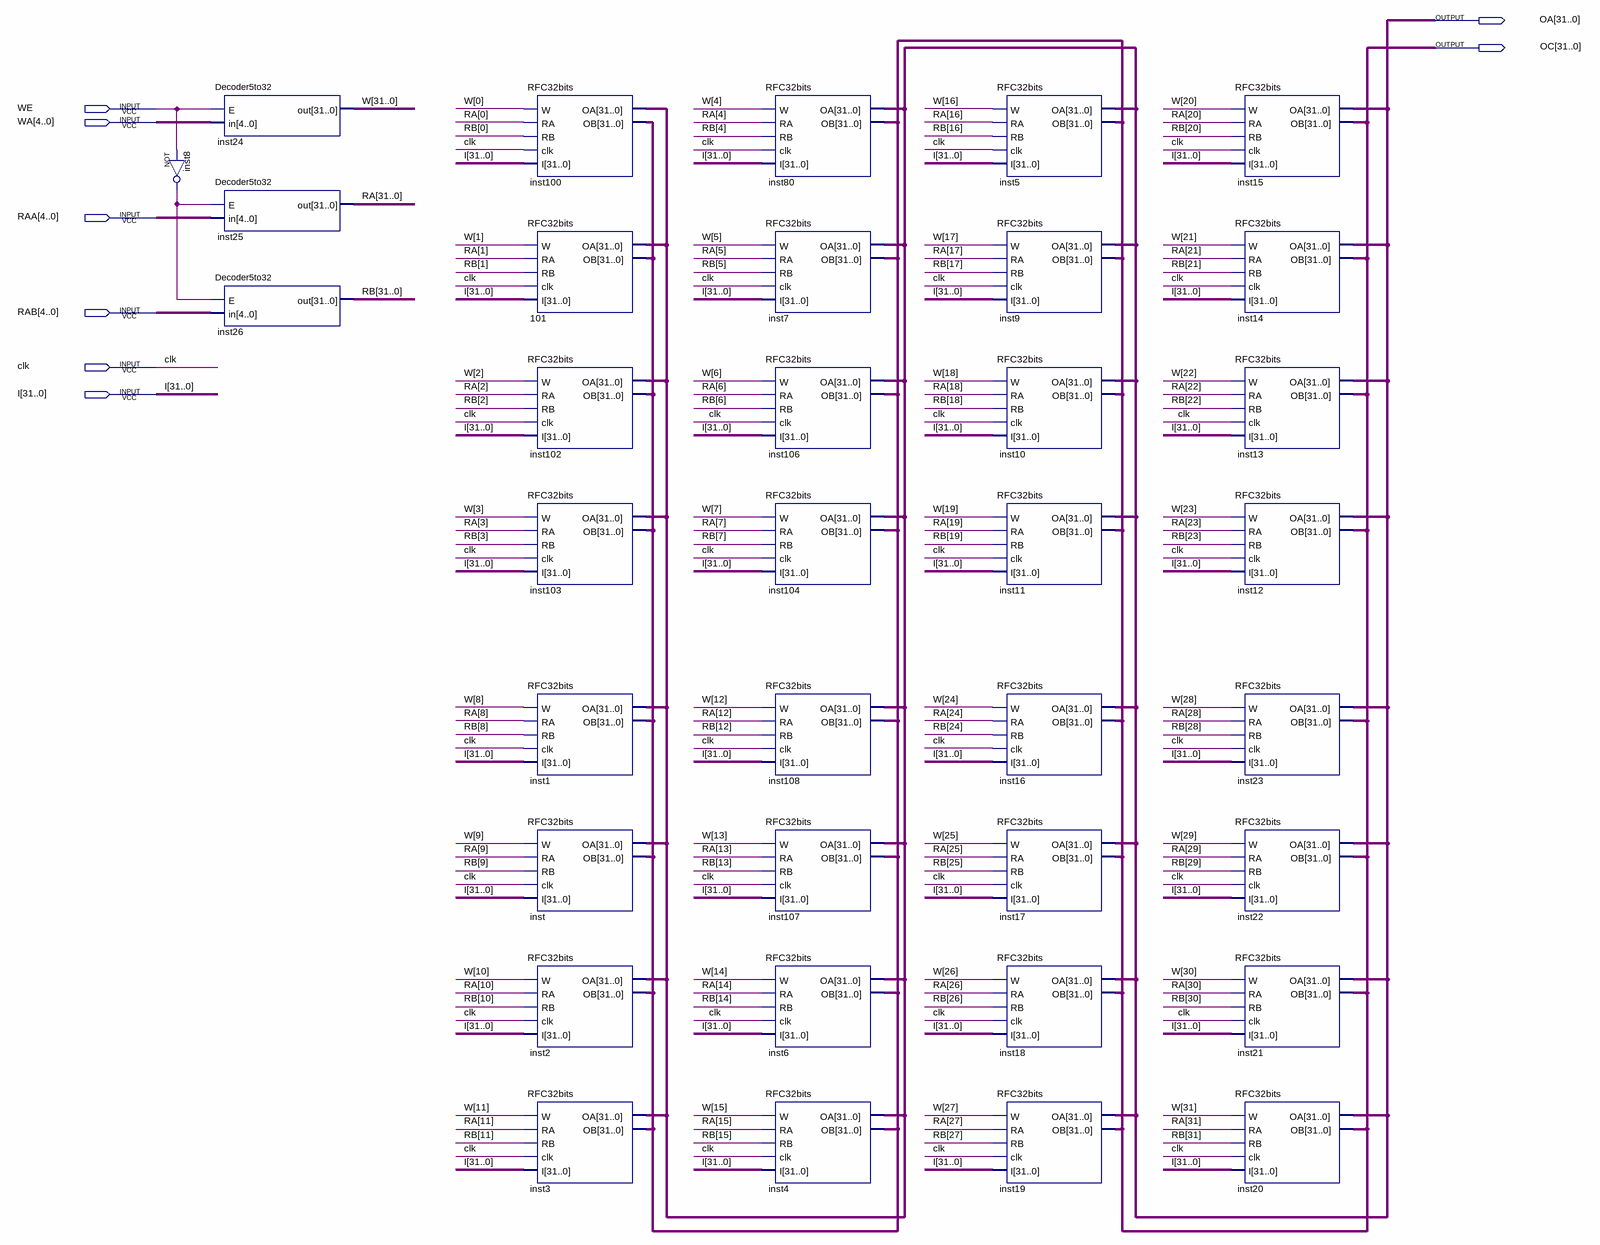
[diagram p0: schematic sheet]
// Quartus schematic RF32-32.bdf as structural Verilog: 36 symbols, 8 pins
module \RF32-32  (
  input  WE,
  input  [4:0] WA,
  input  [4:0] RAA,
  input  [4:0] RAB,
  input  clk,
  input  [31:0] I,
  output [31:0] OA,
  output [31:0] OC
);

  wire inst8_out;
  wire [31:0] RA, RB, W;

  not inst8 (inst8_out, WE);
  Decoder5to32 inst24 (.E(WE), .in(WA), .out(W));
  Decoder5to32 inst25 (.E(inst8_out), .in(RAA), .out(RA));
  Decoder5to32 inst26 (.E(inst8_out), .in(RAB), .out(RB));
  RFC32bits inst100 (.W(W[0]), .RA(RA[0]), .RB(RB[0]), .clk(clk), .I(I), .OA(OA), .OB(OC));
  RFC32bits u_101 (.W(W[1]), .RA(RA[1]), .RB(RB[1]), .clk(clk), .I(I), .OA(OA), .OB(OC));
  RFC32bits inst102 (.W(W[2]), .RA(RA[2]), .RB(RB[2]), .clk(clk), .I(I), .OA(OA), .OB(OC));
  RFC32bits inst103 (.W(W[3]), .RA(RA[3]), .RB(RB[3]), .clk(clk), .I(I), .OA(OA), .OB(OC));
  RFC32bits inst1 (.W(W[8]), .RA(RA[8]), .RB(RB[8]), .clk(clk), .I(I), .OA(OA), .OB(OC));
  RFC32bits inst (.W(W[9]), .RA(RA[9]), .RB(RB[9]), .clk(clk), .I(I), .OA(OA), .OB(OC));
  RFC32bits inst2 (.W(W[10]), .RA(RA[10]), .RB(RB[10]), .clk(clk), .I(I), .OA(OA), .OB(OC));
  RFC32bits inst3 (.W(W[11]), .RA(RA[11]), .RB(RB[11]), .clk(clk), .I(I), .OA(OA), .OB(OC));
  RFC32bits inst80 (.W(W[4]), .RA(RA[4]), .RB(RB[4]), .clk(clk), .I(I), .OA(OA), .OB(OC));
  RFC32bits inst7 (.W(W[5]), .RA(RA[5]), .RB(RB[5]), .clk(clk), .I(I), .OA(OA), .OB(OC));
  RFC32bits inst106 (.W(W[6]), .RA(RA[6]), .RB(RB[6]), .clk(clk), .I(I), .OA(OA), .OB(OC));
  RFC32bits inst104 (.W(W[7]), .RA(RA[7]), .RB(RB[7]), .clk(clk), .I(I), .OA(OA), .OB(OC));
  RFC32bits inst108 (.W(W[12]), .RA(RA[12]), .RB(RB[12]), .clk(clk), .I(I), .OA(OA), .OB(OC));
  RFC32bits inst107 (.W(W[13]), .RA(RA[13]), .RB(RB[13]), .clk(clk), .I(I), .OA(OA), .OB(OC));
  RFC32bits inst6 (.W(W[14]), .RA(RA[14]), .RB(RB[14]), .clk(clk), .I(I), .OA(OA), .OB(OC));
  RFC32bits inst4 (.W(W[15]), .RA(RA[15]), .RB(RB[15]), .clk(clk), .I(I), .OA(OA), .OB(OC));
  RFC32bits inst5 (.W(W[16]), .RA(RA[16]), .RB(RB[16]), .clk(clk), .I(I), .OA(OA), .OB(OC));
  RFC32bits inst9 (.W(W[17]), .RA(RA[17]), .RB(RB[17]), .clk(clk), .I(I), .OA(OA), .OB(OC));
  RFC32bits inst10 (.W(W[18]), .RA(RA[18]), .RB(RB[18]), .clk(clk), .I(I), .OA(OA), .OB(OC));
  RFC32bits inst11 (.W(W[19]), .RA(RA[19]), .RB(RB[19]), .clk(clk), .I(I), .OA(OA), .OB(OC));
  RFC32bits inst16 (.W(W[24]), .RA(RA[24]), .RB(RB[24]), .clk(clk), .I(I), .OA(OA), .OB(OC));
  RFC32bits inst17 (.W(W[25]), .RA(RA[25]), .RB(RB[25]), .clk(clk), .I(I), .OA(OA), .OB(OC));
  RFC32bits inst18 (.W(W[26]), .RA(RA[26]), .RB(RB[26]), .clk(clk), .I(I), .OA(OA), .OB(OC));
  RFC32bits inst19 (.W(W[27]), .RA(RA[27]), .RB(RB[27]), .clk(clk), .I(I), .OA(OA), .OB(OC));
  RFC32bits inst15 (.W(W[20]), .RA(RA[20]), .RB(RB[20]), .clk(clk), .I(I), .OA(OA), .OB(OC));
  RFC32bits inst14 (.W(W[21]), .RA(RA[21]), .RB(RB[21]), .clk(clk), .I(I), .OA(OA), .OB(OC));
  RFC32bits inst13 (.W(W[22]), .RA(RA[22]), .RB(RB[22]), .clk(clk), .I(I), .OA(OA), .OB(OC));
  RFC32bits inst12 (.W(W[23]), .RA(RA[23]), .RB(RB[23]), .clk(clk), .I(I), .OA(OA), .OB(OC));
  RFC32bits inst23 (.W(W[28]), .RA(RA[28]), .RB(RB[28]), .clk(clk), .I(I), .OA(OA), .OB(OC));
  RFC32bits inst22 (.W(W[29]), .RA(RA[29]), .RB(RB[29]), .clk(clk), .I(I), .OA(OA), .OB(OC));
  RFC32bits inst21 (.W(W[30]), .RA(RA[30]), .RB(RB[30]), .clk(clk), .I(I), .OA(OA), .OB(OC));
  RFC32bits inst20 (.W(W[31]), .RA(RA[31]), .RB(RB[31]), .clk(clk), .I(I), .OA(OA), .OB(OC));
endmodule
